# Altium schematic sheet PowerInjectorSchematic.SchDoc
size A
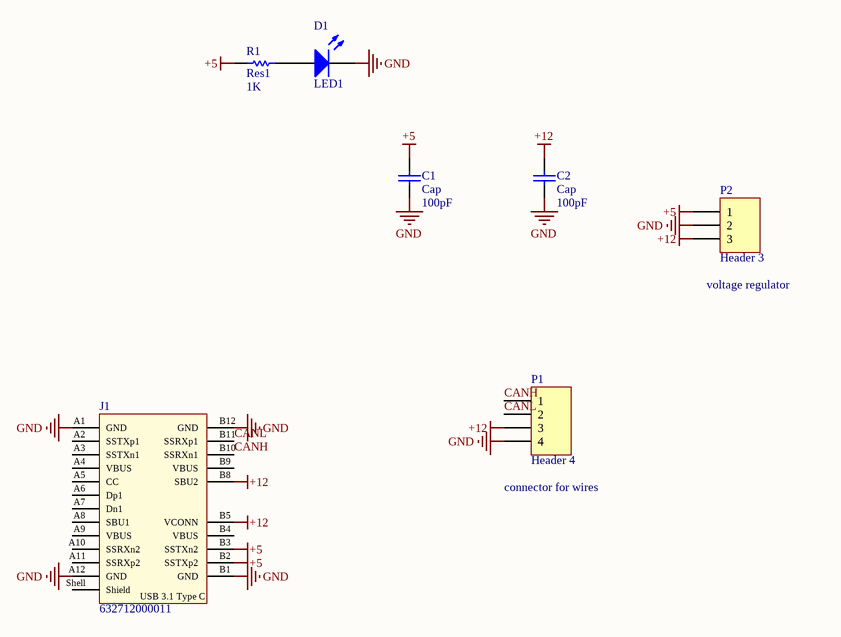
[diagram p0: PowerInjectorSchematic.SchDoc]

## Parts
C1  Cap  value 100pF  [RAD-0.3]
C2  Cap  value 100pF  [RAD-0.3]
D1  LED1  [LED-1]
J1  632712000011  [632712000011]
P1  Header 4  [HDR1X4]
P2  Header 3  [HDR1X3]
R1  Res1  value 1K  [AXIAL-0.3]

## Nets
+5: C1.2 J1.B2(SSTXp2) J1.B3(SSTXn2) P2.1 R1.1
+12: C2.2 J1.B5(VCONN) J1.B8(SBU2) P1.3 P2.3
GND: C1.1 C2.1 D1.2(K) J1.A1(GND) J1.A12(GND) J1.B1(GND) J1.B12(GND) P1.4 P2.2
CANH: J1.B10(SSRXn1) P1.1
CANL: J1.B11(SSRXp1) P1.2
NetD1_1: D1.1(A) R1.2

Not connected (* = marked no-connect by the designer): J1 A2(SSTXp1) A3(SSTXn1) A4(VBUS) A5(CC) A6(Dp1) A7(Dn1) A8(SBU1) A9(VBUS) A10(SSRXn2) A11(SSRXp2) B4(VBUS) B9(VBUS) Shell(Shield)

## Notes on the sheet
- (near P2) voltage regulator
- (near P1) connector for wires
- (in symbol 632712000011) USB 3.1 Type C

## Library data of the parts
C1 C2 = Cap: Capacitor; Published: 8-Jun-2000; LatestRevisionDate: 17-Jul-2002; LatestRevisionNote: Re-released for DXP Platform.; PackageReference: RAD-0.3; Publisher: Altium Limited; PackageDescription: Radial Cap, Thru-Hole; 2 Leads; 0.3 in Pin Spacing
D1 = LED1: Typical RED GaAs LED; Published: 8-Jun-2000; LatestRevisionDate: 08-Jul-2005; LatestRevisionNote: Mech Layer 1 removed.; PackageReference: LED-1; Publisher: Altium Limited; PackageDescription: LED; 2 Leads
J1 = 632712000011: USB 3.1 Type C Plug Horizontal SMT WR-COM; Interface Type: Type C; Sub-Family: USB 3.1; ComponentLink1Description: Manufacturer; ComponentLink1URL: http://www.we-online.de; ComponentLink2Description: Datasheet; ComponentLink2URL: http://katalog.we-online.de/em/datasheet/632712000011.pdf; Part Number: 632712000011; Published Date: April 2017; Publisher: Wurth Elektronik; Gender: Plug; Type: Horizontal; Construction: SMT
P1 = Header 4: Header, 4-Pin; LatestRevisionDate: 17-Jul-2002; LatestRevisionNote: Re-released for DXP Platform.; Publisher: Altium Limited
P2 = Header 3: Header, 3-Pin; LatestRevisionDate: 17-Jul-2002; LatestRevisionNote: Re-released for DXP Platform.; Publisher: Altium Limited
R1 = Res1: Resistor; Published: 8-Jun-2000; LatestRevisionDate: 17-Jul-2002; LatestRevisionNote: Re-released for DXP Platform.; PackageReference: AXIAL-0.3; Publisher: Altium Limited; PackageDescription: Axial Device, Thru-Hole; 2 Leads; 0.3 in Pin Spacing